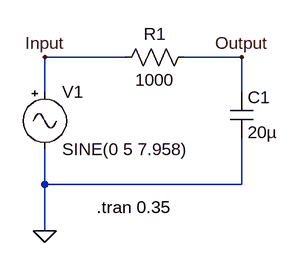
[diagram p0: schematic Circuito RC.asc]
Circuito RC.asc, the LTspice schematic file:
Version 4
SHEET 1 880 680
WIRE 256 64 144 64
WIRE 416 64 336 64
WIRE 144 112 144 64
WIRE 416 112 416 64
WIRE 144 240 144 192
WIRE 416 240 416 176
WIRE 416 240 144 240
WIRE 144 304 144 240
FLAG 144 304 0
FLAG 144 64 Input
FLAG 416 64 Output
SYMBOL res 352 48 R90
WINDOW 0 0 56 VBottom 2
WINDOW 3 32 56 VTop 2
SYMATTR InstName R1
SYMATTR Value 1000
SYMBOL cap 400 112 R0
SYMATTR InstName C1
SYMATTR Value 20µ
SYMBOL Misc\\signal 144 96 R0
WINDOW 123 24 132 Left 2
WINDOW 39 0 0 Left 0
SYMATTR InstName V1
SYMATTR Value SINE(0 5 7.958)
TEXT 216 272 Left 2 !.tran 0.35

The netlist it stands for:
* Circuito RC.asc
R1 Output Input 1000
C1 Output 0 20µ
V1 Input 0 SINE(0 5 7.958)
.tran 0.35
.backanno
.end